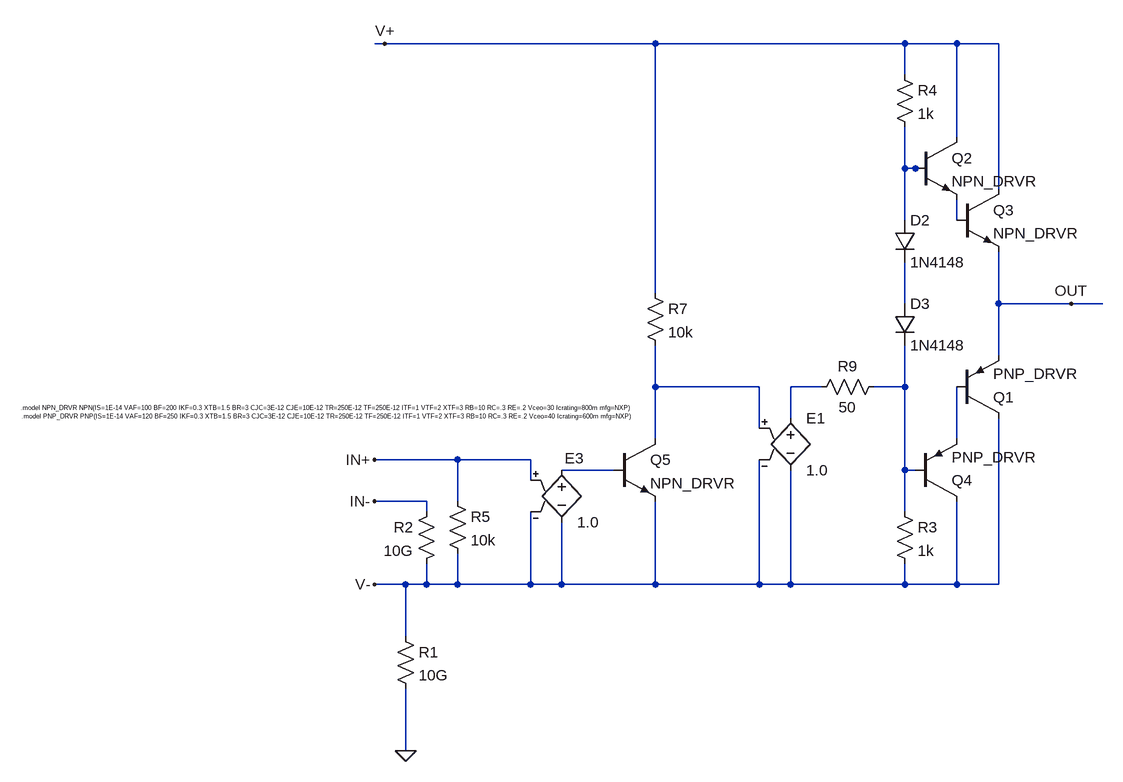
[diagram p0: schematic Output_Stage_Alternative_Transistor_Level.asc]
Output_Stage_Alternative_Transistor_Level.asc, the LTspice schematic file:
Version 4.1
SHEET 1 6960 2676
WIRE 1344 528 1328 528
WIRE 1760 528 1344 528
WIRE 2144 528 1760 528
WIRE 2224 528 2144 528
WIRE 2288 528 2224 528
WIRE 2144 576 2144 528
WIRE 2224 672 2224 528
WIRE 2144 720 2144 656
WIRE 2160 720 2144 720
WIRE 2176 720 2160 720
WIRE 2288 752 2288 528
WIRE 2144 800 2144 720
WIRE 2224 800 2224 768
WIRE 1760 912 1760 528
WIRE 2144 928 2144 864
WIRE 2288 928 2288 848
WIRE 2400 928 2288 928
WIRE 2448 928 2400 928
WIRE 2288 1008 2288 928
WIRE 1760 1056 1760 992
WIRE 1920 1056 1760 1056
WIRE 2016 1056 1968 1056
WIRE 2144 1056 2144 992
WIRE 2144 1056 2096 1056
WIRE 1968 1104 1968 1056
WIRE 1920 1120 1920 1056
WIRE 1760 1136 1760 1056
WIRE 2224 1136 2224 1056
WIRE 1456 1168 1328 1168
WIRE 1568 1168 1456 1168
WIRE 1696 1184 1616 1184
WIRE 2144 1184 2144 1056
WIRE 2160 1184 2144 1184
WIRE 1568 1200 1568 1168
WIRE 1408 1232 1328 1232
WIRE 1456 1232 1456 1168
WIRE 1408 1248 1408 1232
WIRE 2144 1248 2144 1184
WIRE 1376 1360 1328 1360
WIRE 1408 1360 1408 1328
WIRE 1408 1360 1376 1360
WIRE 1456 1360 1456 1312
WIRE 1456 1360 1408 1360
WIRE 1568 1360 1568 1248
WIRE 1568 1360 1456 1360
WIRE 1616 1360 1616 1264
WIRE 1616 1360 1568 1360
WIRE 1760 1360 1760 1232
WIRE 1760 1360 1616 1360
WIRE 1920 1360 1920 1168
WIRE 1920 1360 1760 1360
WIRE 1968 1360 1968 1184
WIRE 1968 1360 1920 1360
WIRE 2144 1360 2144 1328
WIRE 2144 1360 1968 1360
WIRE 2224 1360 2224 1232
WIRE 2224 1360 2144 1360
WIRE 2288 1360 2288 1104
WIRE 2288 1360 2224 1360
WIRE 1376 1440 1376 1360
WIRE 1376 1616 1376 1520
FLAG 1328 1168 IN+
FLAG 2400 928 OUT
FLAG 1376 1616 0
FLAG 1344 528 V+
FLAG 1328 1360 V-
FLAG 1328 1232 IN-
SYMBOL npn 2160 672 R0
SYMATTR InstName Q2
SYMATTR Value NPN_DRVR
SYMBOL npn 2224 752 R0
SYMATTR InstName Q3
SYMATTR Value NPN_DRVR
SYMBOL diode 2128 800 R0
SYMATTR InstName D2
SYMATTR Value 1N4148
SYMBOL e 1968 1088 R0
SYMATTR InstName E1
SYMATTR Value 1.0
SYMBOL res 1440 1216 R0
SYMATTR InstName R5
SYMATTR Value 10k
SYMBOL pnp 2224 1104 M180
SYMATTR InstName Q1
SYMATTR Value PNP_DRVR
SYMBOL pnp 2160 1232 M180
SYMATTR InstName Q4
SYMATTR Value PNP_DRVR
SYMBOL diode 2128 928 R0
SYMATTR InstName D3
SYMATTR Value 1N4148
SYMBOL res 2128 1232 R0
SYMATTR InstName R3
SYMATTR Value 1k
SYMBOL res 2128 560 R0
SYMATTR InstName R4
SYMATTR Value 1k
SYMBOL npn 1696 1136 R0
SYMATTR InstName Q5
SYMATTR Value NPN_DRVR
SYMBOL res 1744 896 R0
SYMATTR InstName R7
SYMATTR Value 10k
SYMBOL e 1616 1168 R0
WINDOW 0 5 -2 Left 2
SYMATTR InstName E3
SYMATTR Value 1.0
SYMBOL res 2112 1040 R90
WINDOW 0 0 56 VBottom 2
WINDOW 3 32 56 VTop 2
SYMATTR InstName R9
SYMATTR Value 50
SYMBOL res 1360 1424 R0
SYMATTR InstName R1
SYMATTR Value 10G
SYMBOL res 1424 1232 M0
SYMATTR InstName R2
SYMATTR Value 10G
TEXT 1720 1088 Right 0 !.model NPN_DRVR NPN(IS=1E-14 VAF=100 BF=200 IKF=0.3 XTB=1.5 BR=3 CJC=3E-12 CJE=10E-12 TR=250E-12 TF=250E-12 ITF=1 VTF=2 XTF=3 RB=10 RC=.3 RE=.2 Vceo=30 Icrating=800m mfg=NXP)\n.model PNP_DRVR PNP(IS=1E-14 VAF=120 BF=250 IKF=0.3 XTB=1.5 BR=3 CJC=3E-12 CJE=10E-12 TR=250E-12 TF=250E-12 ITF=1 VTF=2 XTF=3 RB=10 RC=.3 RE=.2 Vceo=40 Icrating=600m mfg=NXP)

The netlist it stands for:
* Output_Stage_Alternative_Transistor_Level.asc
Q2 V+ N001 N002 0 NPN_DRVR
Q3 V+ N002 OUT 0 NPN_DRVR
D2 N001 N003 1N4148
E1 N005 V- N004 V- 1.0
R5 IN+ V- 10k
Q1 V- N007 OUT 0 PNP_DRVR
Q4 V- N006 N007 0 PNP_DRVR
D3 N003 N006 1N4148
R3 N006 V- 1k
R4 V+ N001 1k
Q5 N004 N008 V- 0 NPN_DRVR
R7 V+ N004 10k
E3 N008 V- IN+ V- 1.0
R9 N006 N005 50
R1 V- 0 10G
R2 IN- V- 10G
.model D D
.lib standard.dio
.model NPN NPN
.model PNP PNP
.lib standard.bjt
.model NPN_DRVR NPN(IS=1E-14 VAF=100 BF=200 IKF=0.3 XTB=1.5 BR=3 CJC=3E-12 CJE=10E-12 TR=250E-12 TF=250E-12 ITF=1 VTF=2 XTF=3 RB=10 RC=.3 RE=.2 Vceo=30 Icrating=800m mfg=NXP)
.model PNP_DRVR PNP(IS=1E-14 VAF=120 BF=250 IKF=0.3 XTB=1.5 BR=3 CJC=3E-12 CJE=10E-12 TR=250E-12 TF=250E-12 ITF=1 VTF=2 XTF=3 RB=10 RC=.3 RE=.2 Vceo=40 Icrating=600m mfg=NXP)
.backanno
.end